# Altium schematic sheet S1.SchDoc: Codename S1
size A3; Engineer: Samuel Sadok; Revision: 1; SheetNumber: 1; SheetTotal: 1
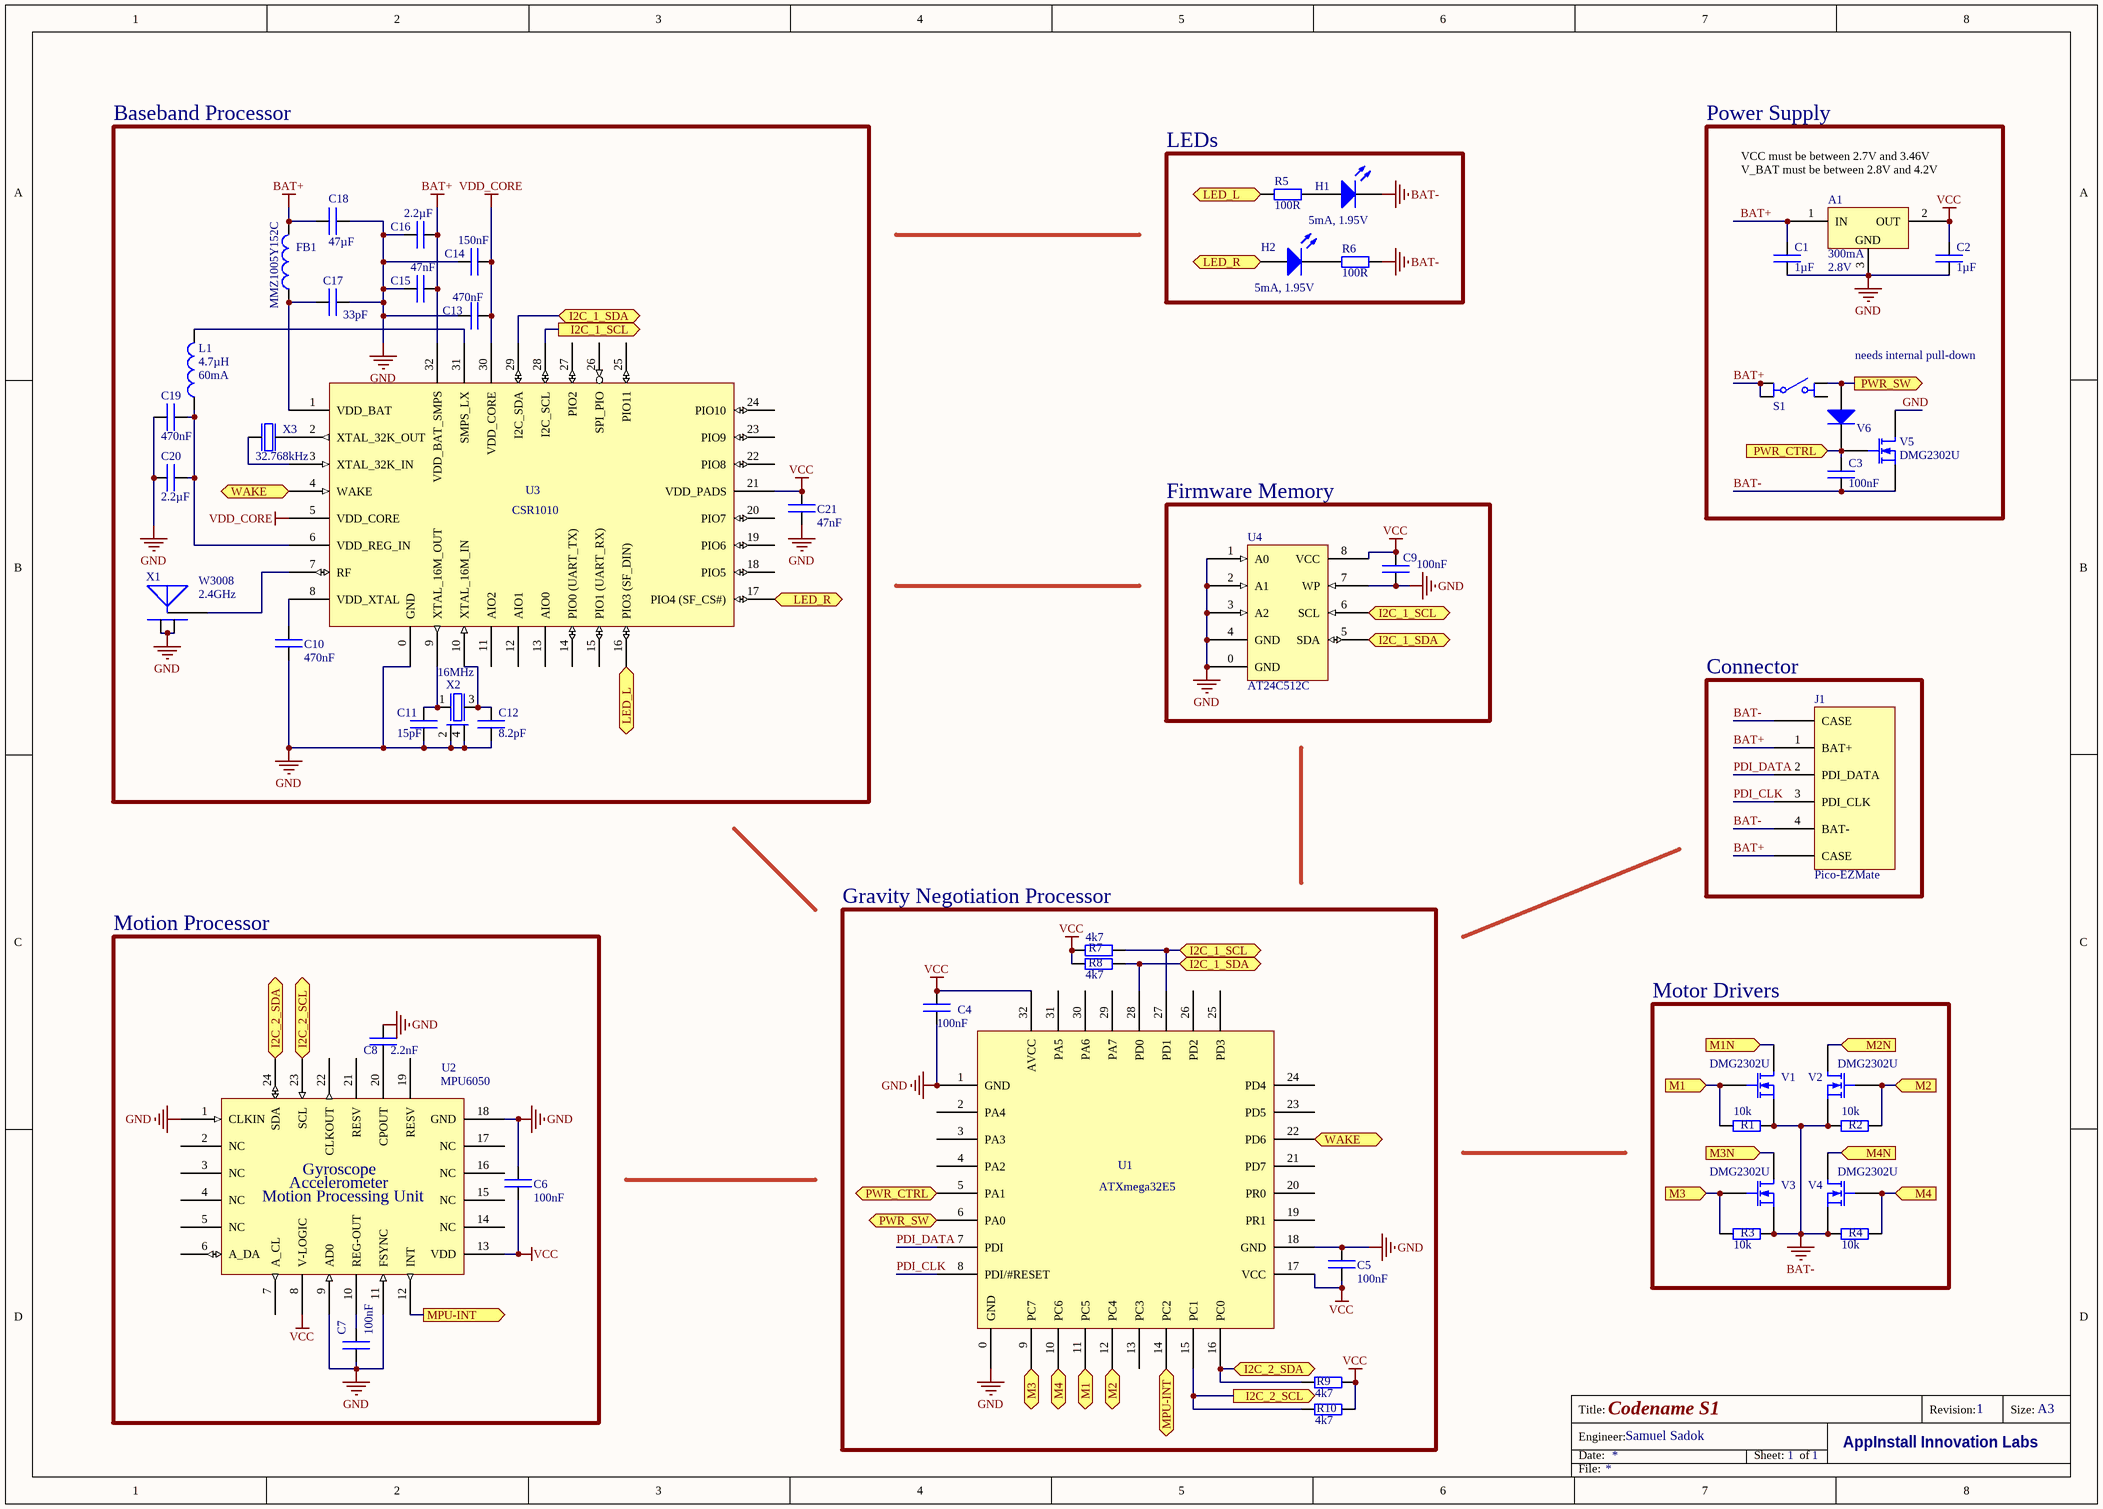
[diagram p0: S1.SchDoc]

## Parts
A1  Current: 300mA  Voltage: 2.8V  [SOT23]  (hidden comment: AP7333-28SA)
C1  Capacity: 1µF  [0201 (C)]  (hidden comment: Cap 1µF)
C2  Capacity: 1µF  [0201 (C)]  (hidden comment: Cap 1µF)
C3  Capacity: 100nF  [0201 (C)]  (hidden comment: Cap 100nF)
C4  Capacity: 100nF  [0201 (C)]  (hidden comment: Cap 100nF)
C5  Capacity: 100nF  [0201 (C)]  (hidden comment: Cap 100nF)
C6  Capacity: 100nF  [0201 (C)]  (hidden comment: Cap 100nF)
C7  Capacity: 100nF  [0201 (C)]  (hidden comment: Cap 100nF)
C8  Capacity: 2.2nF  [0201 (C)]  (hidden comment: Cap 2.2nF)
C9  Capacity: 100nF  [0201 (C)]  (hidden comment: Cap 100nF)
C10  Capacity: 470nF  [0201 (C)]  (hidden comment: Cap 470nF)
C11  Capacity: 15pF  [0201 (C)]  (hidden comment: Cap 15pF)
C12  Capacity: 8.2pF  [0201 (C)]  (hidden comment: Cap 8.2pF)
C13  Capacity: 470nF  [0201 (C)]  (hidden comment: Cap 470nF)
C14  Capacity: 150nF  [0201 (C)]  (hidden comment: Cap 150nF)
C15  Capacity: 47nF  [0201 (C)]  (hidden comment: Cap 47nF)
C16  Capacity: 2.2µF  [0402 (C)]  (hidden comment: Cap 2.2µF)
C17  Capacity: 33pF  [0201 (C)]  (hidden comment: Cap 33pF)
C18  Capacity: 47µF  [0805 (C)]  (hidden comment: Cap 47µF)
C19  Capacity: 470nF  [0201 (C)]  (hidden comment: Cap 470nF)
C20  Capacity: 2.2µF  [0402 (C)]  (hidden comment: Cap 2.2µF)
C21  Capacity: 47nF  [0201 (C)]  (hidden comment: Cap 47nF)
FB1  MMZ1005Y152C  [0402 (R)]  (net tie, no BOM)
H1  Specs: 5mA, 1.95V  [KLTFSN2K5200]  (hidden comment: LED1)
H2  Specs: 5mA, 1.95V  [KLTFSN2K5200]  (hidden comment: LED1)
J1  Pico-EZMate  [Pico-EZMate (4Pin)]
L1  value 4.7µH  Current: 60mA  [0603 (L)]  (hidden comment: L 4.7µH)
R1  value 10k  [0201 (R)]  (hidden comment: Res 10k)
R2  value 10k  [0201 (R)]  (hidden comment: Res 10k)
R3  value 10k  [0201 (R)]  (hidden comment: Res 10k)
R4  value 10k  [0201 (R)]  (hidden comment: Res 10k)
R5  value 100R  [0201 (R)]  (hidden comment: Res 100R)
R6  value 100R  [0201 (R)]  (hidden comment: Res 100R)
R7  value 4k7  [0201 (R)]  (hidden comment: Res 4k7)
R8  value 4k7  [0201 (R)]  (hidden comment: Res 4k7)
R9  value 4k7  [0201 (R)]  (hidden comment: Res 4k7)
R10  value 4k7  [0201 (R)]  (hidden comment: Res 4k7)
S1  TL1014BF160QG  [Switch Right Angle]  (value not drawn)
U1  ATXmega32E5  [QFN-32 (5x5mm)]
U2  MPU6050  [LQFN24 (4x4mm)]
U3  CSR1010  [QFN-32 (5x5mm)]
U4  AT24C512C  [UDFN-8 (3x2mm)]
V1  DMG2302U  [SOT23]
V2  DMG2302U  [SOT23]
V3  DMG2302U  [SOT23]
V4  DMG2302U  [SOT23]
V5  DMG2302U  [SOT23]
V6  1N4148W  [SOD923]  (value not drawn)
X1  W3008  Frequency: 2.4GHz  [Antenna 3.2x1.6mm (W3008)]
X2  Frequency: 16MHz  [Crystal 1.6mm x 2mm]  (hidden comment: 8Y-16.000MAAV-T)
X3  Frequency: 32.768kHz  [Crystal 1mm x 1.6mm]  (hidden comment: ABS05-32.768KHZ-9-T)

## Blocks framed on the sheet
Baseband Processor: C10-C21 FB1 L1 U3 X1-X3
Power Supply: A1 C1-C3 S1 V5 V6
LEDs: H1 H2 R5 R6
Firmware Memory: C9 U4
Connector: J1
Gravity Negotiation Processor: C4 C5 R7-R10 U1
Motion Processor: C6-C8 U2
Motor Drivers: R1-R4 V1-V4

## Ports
I2C_1_SCL (bidir), I2C_1_SCL (in), I2C_1_SCL (out), I2C_1_SDA (bidir), I2C_2_SCL (out), I2C_2_SDA (bidir), LED_L (in), LED_L (out), LED_R (in), LED_R (out), M1 (in), M1 (out), M1N (in), M2 (in), M2 (out), M2N (in), M3 (in), M3 (out), M3N (in), M4 (in), M4 (out), M4N (in), MPU-INT (in), MPU-INT (out), PWR_CTRL (in), PWR_CTRL (out), PWR_SW (in), PWR_SW (out), WAKE (in), WAKE (out)

## Nets
BAT+: A1.1(IN) C1.1 C15.2 C16.2 C18.2 FB1.2 J1.0b(CASE) J1.1(BAT+) S1.1 S1.3 U3.32(VDD_BAT_SMPS)
BAT-: C3.2 H1.2(K) J1.0a(CASE) J1.4(BAT-) R1.2 R2.1 R3.2 R4.1 R6.2 V1.2(S) V2.2(S) V3.2(S) V4.2(S) V5.2(S)
GND: A1.3(GND) C1.2 C2.2 C4.2 C5.1 C6.2 C7.1 C8.2 C9.2 C10.2 C11.1 C12.2 C13.1 C14.2 C15.1 C16.1 C17.1 C18.1 C19.1 C20.2 C21.2 U1.0(GND) U1.1(GND) U1.18(GND) U2.1(CLKIN) U2.9(AD0) U2.11(FSYNC) U2.18(GND) U3.0(GND) U4.0(GND) U4.1(A0) U4.2(A1) U4.3(A2) U4.4(GND) U4.7(WP) V5.3(D) X1.2 X1.3 X2.2 X2.4
VCC: A1.2(OUT) C2.1 C4.1 C5.2 C6.1 C9.1 C21.1 R7.1 R8.1 R9.1 R10.1 U1.17(VCC) U1.32(AVCC) U2.8(V-LOGIC) U2.13(VDD) U3.21(VDD_PADS) U4.8(VCC)
VDD_CORE: C13.2 C14.1 U3.5(VDD_CORE) U3.30(VDD_CORE)
I2C_1_SCL: R7.2 U1.27(PD1) U3.28(I2C_SCL) U4.6(SCL) ; port I2C_1_SCL
I2C_1_SDA: R8.2 U1.28(PD0) U3.29(I2C_SDA) U4.5(SDA) ; port I2C_1_SDA
I2C_2_SCL: R10.2 U1.15(PC1) U2.23(SCL) ; port I2C_2_SCL
I2C_2_SDA: R9.2 U1.16(PC0) U2.24(SDA) ; port I2C_2_SDA
LED_L: R5.1 U3.16(PIO3_(SF_DIN)) ; port LED_L
LED_R: H2.1(A) U3.17(PIO4_(SF_CS#)) ; port LED_R
M1: R1.1 U1.11(PC5) V1.1(G) ; port M1
M1N: V1.3(D) ; port M1N
M2: R2.2 U1.12(PC4) V2.1(G) ; port M2
M2N: V2.3(D) ; port M2N
M3: R3.1 U1.9(PC7) V3.1(G) ; port M3
M3N: V3.3(D) ; port M3N
M4: R4.2 U1.10(PC6) V4.1(G) ; port M4
M4N: V4.3(D) ; port M4N
MPU-INT: U1.14(PC2) U2.12(INT) ; port MPU-INT
PDI_CLK: J1.3(PDI_CLK) U1.8(PDI/#RESET)
PDI_DATA: J1.2(PDI_DATA) U1.7(PDI)
PWR_CTRL: C3.1 U1.5(PA1) V5.1(G) V6.K ; port PWR_CTRL
PWR_SW: S1.2 U1.6(PA0) V6.A ; port PWR_SW
WAKE: U1.22(PD6) U3.4(WAKE) ; port WAKE
NetC7_2: C7.2 U2.10(REG-OUT)
NetC8_1: C8.1 U2.20(CPOUT)
NetC10_1: C10.1 U3.8(VDD_XTAL)
NetC11_2: C11.2 U3.9(XTAL_16M_OUT) X2.1
NetC12_1: C12.1 U3.10(XTAL_16M_IN) X2.3
NetC17_2: C17.2 FB1.1 U3.1(VDD_BAT)
NetC19_2: C19.2 C20.1 L1.1 U3.6(VDD_REG_IN)
NetH1_1: H1.1(A) R5.2
NetH2_2: H2.2(K) R6.1
NetL1_2: L1.2 U3.31(SMPS_LX)
NetU3_2: U3.2(XTAL_32K_OUT) X3.2
NetU3_3: U3.3(XTAL_32K_IN) X3.1
NetU3_7: U3.7(RF) X1.1

Not connected (* = marked no-connect by the designer): S1 4; U1 2(PA4) 3(PA3) 4(PA2) 13(PC3) 19(PR1) 20(PR0) 21(PD7) 23(PD5) 24(PD4) 25(PD3) 26(PD2) 29(PA7) 30(PA6) 31(PA5); U2 2(NC) 3(NC) 4(NC) 5(NC) 6(A_DA) 7(A_CL) 14(NC) 15(NC) 16(NC) 17(NC) 19(RESV) 21(RESV) 22(CLKOUT); U3 11(AIO2) 12(AIO1) 13(AIO0) 14(PIO0_(UART_TX)) 15(PIO1_(UART_RX)) 18(PIO5) 19(PIO6) 20(PIO7) 22(PIO8) 23(PIO9) 24(PIO10) 25(PIO11) 26(SPI_PIO) 27(PIO2)

## Notes on the sheet
- (near A1) VCC must be between 2.7V and 3.46V
  V_BAT must be between 2.8V and 4.2V
- needs internal pull-down
- (near U2) Accelerometer
- (near U2) Gyroscope
- (near U2) Motion Processing Unit
- Title:
- Date:
- Engineer:
- Sheet:     of
- AppInstall Innovation Labs
- Revision:
- Size:
- A3
- File:

## Library data of the parts
A1 = AP7333-28SA: Low Dropout Regulator 2.8V, 300mA; Manufacturer: Diodes Inc.; Dropout Voltage: 300mV; Input Voltage: 2V ... 6V; Digi-Key: AP7333-28SAG-7DICT-ND
C1 C2 = Cap 1µF: Ceramic Capacitor 1µF; Voltage: 25V; Supplier 1: Digi-Key; Supplier Part Number 1: 445-1590-1-ND
C3-C7 C9 = Cap 100nF: Ceramic Capacitor 100nF; Voltage: 25V
C8 = Cap 2.2nF: Ceramic Capacitor 2.2nF; Voltage: 25V; Supplier 1: Digi-Key; Supplier Part Number 1: 445-7525-1-ND
C10 C13 C19 = Cap 470nF: Ceramic Capacitor 470nF; Voltage: 25V
C11 = Cap 15pF: Ceramic Capacitor 15pF; Voltage: 50V; Digi-Key: 311-1017-1-ND
C12 = Cap 8.2pF: Ceramic Capacitor 8.2pF; Voltage: 50V; Digi-Key: 311-1012-1-ND
C14 = Cap 150nF: Ceramic Capacitor 150nF; Voltage: 50V; Digi-Key: 311-1012-1-ND
C15 C21 = Cap 47nF: Ceramic Capacitor 47nF; Voltage: 50V; Digi-Key: 311-1012-1-ND
C16 C20 = Cap 2.2µF: Ceramic Capacitor 2.2µF; Voltage: 25V; Supplier 1: Digi-Key; Supplier Part Number 1: 445-3459-1-ND
C17 = Cap 33pF: Ceramic Capacitor 33pF; Voltage: 50V; Digi-Key: 311-1012-1-ND
C18 = Cap 47µF: Ceramic Capacitor 47µF; Voltage: 50V; Digi-Key: 311-1012-1-ND
FB1 = Filter: HF Filter; Digi-Key: 445-2158-1-ND
H1 H2 = LED1: Side View LED; Published: 8-Jun-2000; LatestRevisionDate: 08-Jul-2005; LatestRevisionNote: Mech Layer 1 removed.; PackageReference: LED-1; Publisher: Altium Limited; PackageDescription: LED; 2 Leads; Supplier 1: Digi-Key; Supplier Part Number 1: P14180CT-ND
J1 = S1 Connector: Programming & Charging Connector for S1; Digi-Key: WM4460CT-ND; Plug with Harness (Digi-Key): WM9591-ND; Plug (Digi-Key): WM4362-ND; Pins for Plug (Digi-Key): WM3992CT-ND
L1 = L 4.7µH: Inductor 4.7µH; Digi-Key: 445-3165-1-ND
R1-R4 = Res 10k: Resistor 10k; Published: 8-Jun-2000; LatestRevisionDate: 17-Jul-2002; LatestRevisionNote: Re-released for DXP Platform.; PackageReference: AXIAL-0.4; Publisher: Altium Limited; PackageDescription: Axial Device, Thru-Hole; 2 Leads; 0.4 in Pin Spacing; Supplier 1: Digi-Key; Supplier Part Number 1: RMCF0805FT10K0CT-ND
R5 R6 = Res 100R: Resistor 100R; Published: 8-Jun-2000; LatestRevisionDate: 17-Jul-2002; LatestRevisionNote: Re-released for DXP Platform.; PackageReference: AXIAL-0.4; Publisher: Altium Limited; PackageDescription: Axial Device, Thru-Hole; 2 Leads; 0.4 in Pin Spacing; Supplier 1: Digi-Key; Supplier Part Number 1: RMCF0805FT100RCT-ND
R7-R10 = Res 4k7: Resistor 4k7; Published: 8-Jun-2000; LatestRevisionDate: 17-Jul-2002; LatestRevisionNote: Re-released for DXP Platform.; PackageReference: AXIAL-0.4; Publisher: Altium Limited; PackageDescription: Axial Device, Thru-Hole; 2 Leads; 0.4 in Pin Spacing; Supplier 1: Digi-Key; Supplier Part Number 1: RMCF0805FT4K70CT-ND
S1 = TL1014BF160QG: Tactile Switch, Right Angle; Digi-Key: EG5042CT-ND
U1 = Xmega32E5: 8-Bit AVR Microcontroller; Manufacturer: Atmel; Flash: 32kB; RAM: 4kB; EEPROM: 1kB; Speed: 32MHz; Digi-Key: ATXMEGA32E5-MU-ND
U2 = MPU6050: 9DOF Motion Processing Unit; Manufacturer: Invensense; Digi-Key: 1428-1007-1-ND
U3 = CSR1010: Bluetooth v4.0 Low Energy Chip; Digi-Key: CSR1010A05-IQQM-RCT-ND
U4 = AT24C512C-MAHM: 512kbit I2C EEPROM; Manufacturer: Atmel; Voltage: 1.7V - 3.6V; Speed: 400kHz (1.7V), 1MHz (2.5V); Density: 512kbit (65536 Bytes); Digi-Key: AT24C512C-MAHM-TCT-ND
V1-V5 = DMG2302U: MOSFET N-Channel; Manufacturer: Diodes Inc.; GS Threshold Voltage: 1V; Current: 3.4A (Vgs = 1.5V); Digi-Key: DMG2302U-7DICT-ND
V6 = Diode: Forward Voltage: 1.25V; Current: 150mA; Digi-Key: BAS16SLCT-ND
X1 = Antenna 2.4GHz: Manufacturer: Pulse Electronics Coorp.; Compliance: Bluetooth; Digi-Key: 553-1530-1-ND
X2 = Crystal 16MHz: Load Capacitance: 8pF; Digi-Key: 887-2003-1-ND
X3 = Crystal 32.768kHz: Load Capacitance: 9pF; Digi-Key: 535-11897-1-ND